# EAGLE design piezo-preamp-alex-rice-FETS v4 9V (EAGLE 6.5.0)
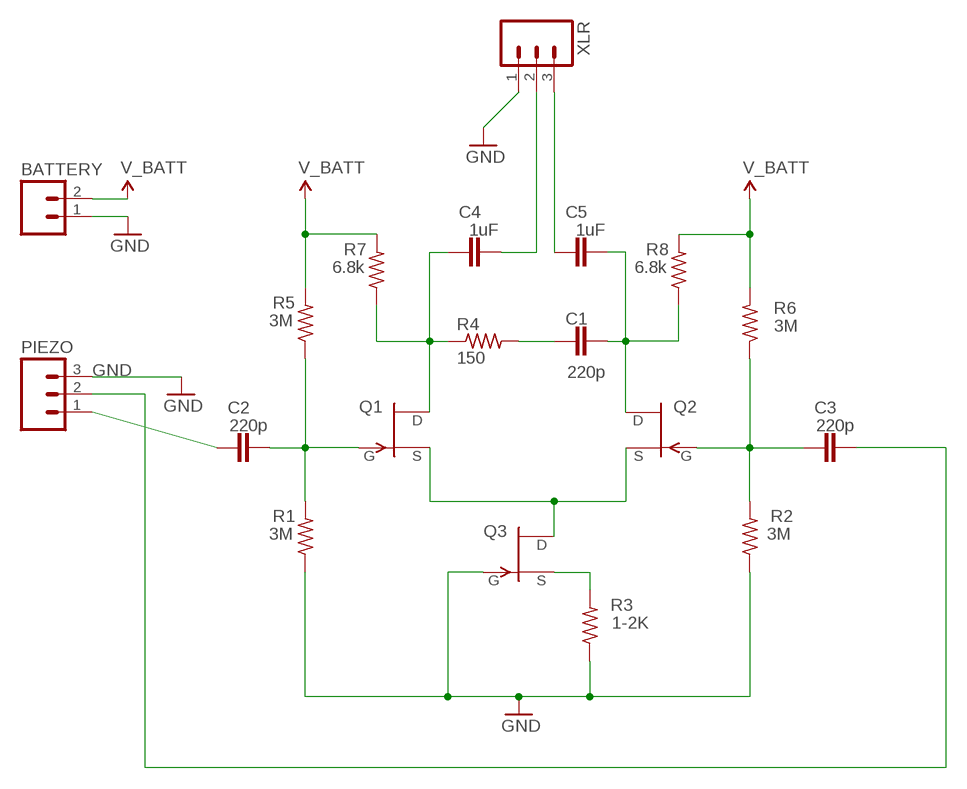
[diagram p0: schematic, sheet 1]

## Parts
BATTERY  M02PTH  [1X02]
C1  220p  C-EU050-030X075  [C050-030X075]
C2  220p  C-EU050-030X075  [C050-030X075]
C3  220p  C-EU050-030X075  [C050-030X075]
C4  1uF  C-EU050-030X075  [C050-030X075]
C5  1uF  C-EU050-030X075  [C050-030X075]
PIEZO  M03PTH  [1X03]
Q1  2N3819  2N3819-WIDETO92_WIDE  [TO92]
Q2  2N3819-WIDETO92_WIDE  [TO92]
Q3  2N3819-WIDETO92_WIDE  [TO92]
R1  3M  R-US_0204/5  [0204/5]
R2  3M  R-US_0204/5  [0204/5]
R3  1-2K  R-US_0204/5  [0204/5]
R4  150  R-US_0204/5  [0204/5]
R5  3M  R-US_0204/5  [0204/5]
R6  3M  R-US_0204/5  [0204/5]
R7  6.8k  R-US_0204/5  [0204/5]
R8  6.8k  R-US_0204/5  [0204/5]
XLR  M03PTH  [1X03]

## Nets
GND: BATTERY.1 PIEZO.3 Q3.2(G) R1.1 R2.1 R3.1 XLR.1
N$1: C5.1 XLR.3
N$3: C1.1 R4.2
N$4: C3.1 Q2.2(G) R2.2 R6.1
N$5: C2.2 Q1.2(G) R1.2 R5.1
N$7: C4.1 Q1.1(D) R4.1 R7.1
N$8: Q3.3(S) R3.2
N$9: C1.2 C5.2 Q2.1(D) R8.1
N$10: C2.1 PIEZO.1
N$11: Q1.3(S) Q2.3(S) Q3.1(D)
N$12: C3.2 PIEZO.2
N$13: C4.2 XLR.2
V_BATT: BATTERY.2 R5.2 R6.2 R7.2 R8.2

## Library data of the parts
BATTERY = SparkFun-Connectors:M02: Header 2 Standard 2-pin 0.1" header. Use with straight break away headers (SKU : PRT-00116), right angle break away headers (PRT-00553), swiss pins (PRT-00743), machine pins (PRT-00117), and female headers (PRT-00115). Molex polarized connector foot print use with SKU : PRT-08233 with associated crimp pins and housings.
C1-C5 = rcl:C-EU: CAPACITOR, European symbol
PIEZO = SparkFun-Connectors:M03: Header 3 Standard 3-pin 0.1" header. Use with straight break away headers (SKU : PRT-00116), right angle break away headers (PRT-00553), swiss pins (PRT-00743), machine pins (PRT-00117), and female headers (PRT-00115). Molex polarized connector foot print use with SKU : PRT-08232 with associated crimp pins and housings.; GND: GND
Q1-Q3 = T092_wide:2N3819-WIDE: N-Channel Junction FET
R1-R3 R5-R8 = rcl:R-US_: RESISTOR, American symbol
R4 = resistor:R-US_: RESISTOR, American symbol
XLR = SparkFun-Connectors:M03: Header 3 Standard 3-pin 0.1" header. Use with straight break away headers (SKU : PRT-00116), right angle break away headers (PRT-00553), swiss pins (PRT-00743), machine pins (PRT-00117), and female headers (PRT-00115). Molex polarized connector foot print use with SKU : PRT-08232 with associated crimp pins and housings.

## Board
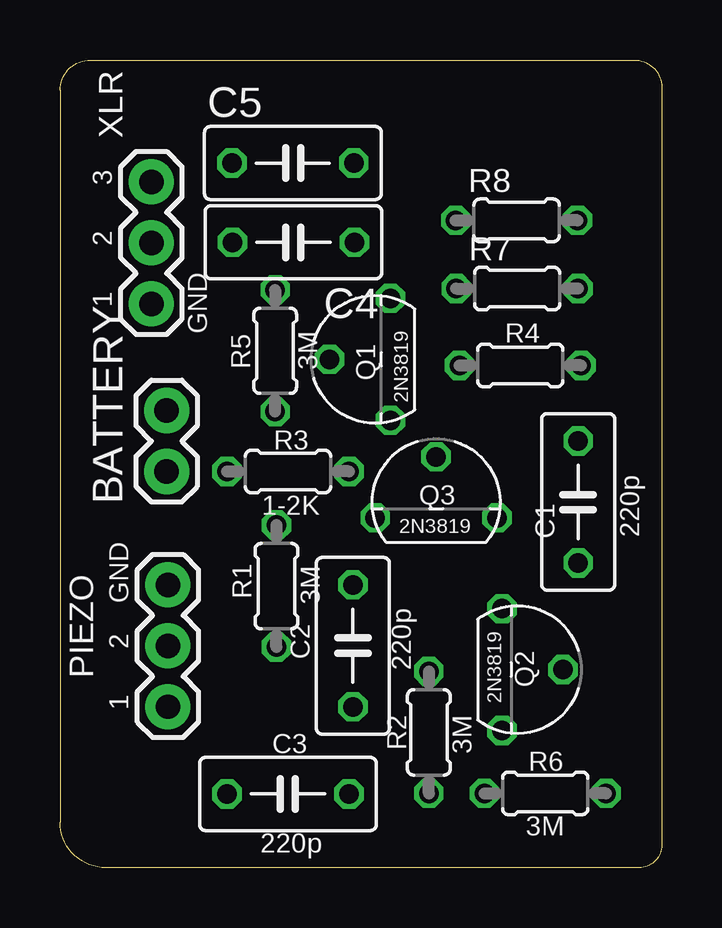
[diagram p1: board, top side]
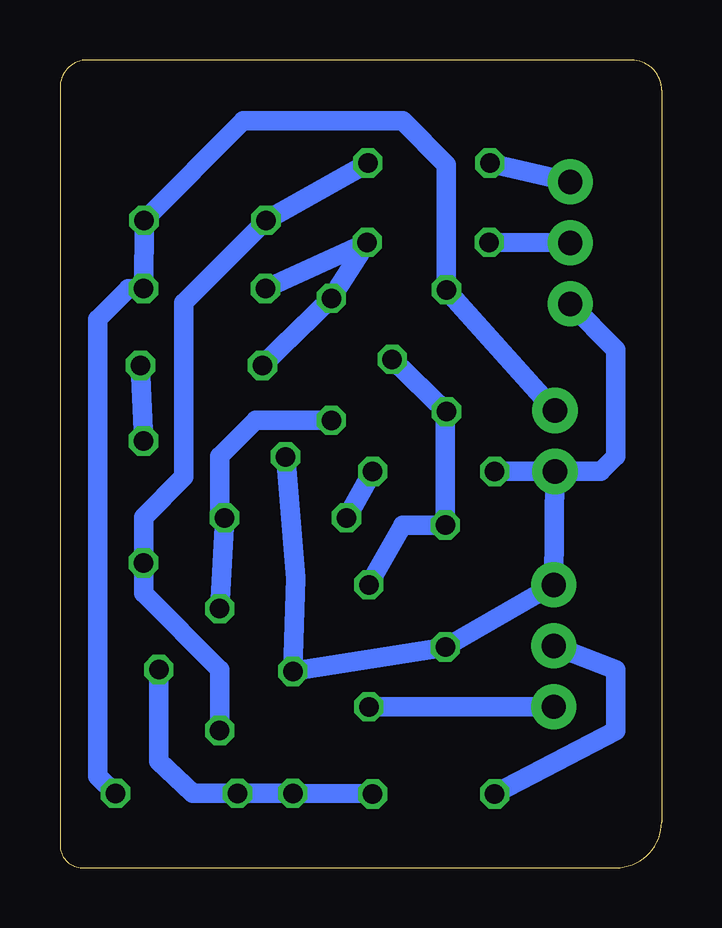
[diagram p2: board, bottom side, seen from below]

Size 25.07 x 33.66 mm. Coordinates in mm from the lower left corner, seen from the top.
Outline: 0,32.38 0,1.91 arc90 1.91,0 24.13,0 arc90 25.07,0.94 25.07,32.51 arc90 23.93,33.66 1.27,33.66 arc90 0,32.38
Copper layers (1*16): Top 0.0356mm / dielectric 1.5011mm / Bottom 0.0356mm
Design rules "default": minimum track width 6mil, minimum drill 13mil, track to track 6mil, track to pad 6mil, pad to pad 6mil, via to via 6mil, smd to smd 6mil, copper to edge 15mil, drill to drill 6mil, minimum pad ring 7mil, minimum via ring 7mil, stop-mask expansion 4mil, vias tented up to drill 0mil, thermal gap 10mil

### Footprints (pad centres in the part's own frame; a part is rotated, then mirrored left to right if it is on the bottom)
1X02 = drill 1.016 pad 1.88: 1 0,0; 2 2.54,0
C050-030X075 = drill 0.813 octagon: 1 -2.54,0; 2 2.54,0
1X03 = drill 1.016 pad 1.88: 1 0,0; 2 2.54,0; 3 5.08,0
TO92 = drill 0.813 octagon: 1 2.54,-0.635; 2 0,1.905; 3 -2.54,-0.635
0204/5 = drill 0.813 octagon: 1 -2.54,0; 2 2.54,0

### Placement (x,y rotation side)
BATTERY  4.45,16.51 90 top
C1  21.59,15.24 270 top
C2  12.2,9.25 90 top
C3  9.5,3.07 180 top
C4  9.73,26.06 180 top
C5  9.7,29.36 0 top
PIEZO  4.5,6.71 90 top
Q1  13.13,21.18 90 top
Q2  19.05,8.26 270 top
Q3  15.67,15.21 0 top
R1  9.02,11.73 90 top
R2  15.37,5.64 270 top
R3  9.5,16.51 0 top
R4  19.18,20.93 0 top
R5  8.97,21.54 90 top
R6  20.22,3.1 0 top
R7  19.05,24.13 0 top
R8  19.02,26.97 0 top
XLR  3.81,23.5 90 top

### Tracks (layer width: path | path; a pad name or v marks a point on that pad's centre or on a via)
GND
  Bottom 0.813: BATTERY.1 PIEZO.3 R1.1 R2.1 15.24,12.06 Q3.2 | BATTERY.1 R3.1 | BATTERY.1 2.54,16.51 1.91,17.14 1.91,21.59 XLR.1
N$1
  Bottom 0.813: XLR.3 C5.1
N$3
  Bottom 0.813: R4.2 C1.1
N$4
  Bottom 0.813: C3.1 R2.2 R6.1 19.53,3.1 20.95,4.45 Q2.2
N$5
  Bottom 0.813: Q1.2 R5.1 9.02,18.95 R1.2 10.78,14.28 C2.2
N$7
  Bottom 0.813: R4.1 Q1.1 C4.1 R7.1
N$8
  Bottom 0.813: R3.2 Q3.3
N$9
  Bottom 0.813: C5.2 R8.1 19.91,23.55 19.91,16.28 21.59,14.61 C1.2 21.59,11.43 18.41,8.26 Q2.1
N$10
  Bottom 0.813: C2.1 PIEZO.1
N$11
  Bottom 0.813: Q1.3 16.92,18.64 18.41,17.14 18.41,14.78 Q3.1 Q2.3
N$12
  Bottom 0.813: PIEZO.2 1.91,8.26 1.91,5.71 C3.2
N$13
  Bottom 0.813: XLR.2 C4.2
V_BATT
  Bottom 0.813: BATTERY.2 R5.2 8.97,29.29 10.79,31.11 17.42,31.11 R8.2 R7.2 22.23,24.13 23.5,22.86 23.5,3.81 R6.2